# Altium schematic sheet 09_MRAM_RTC_WDT.SchDoc
size 420 x 297 mm; SheetNumber: 16; SheetTotal: 29
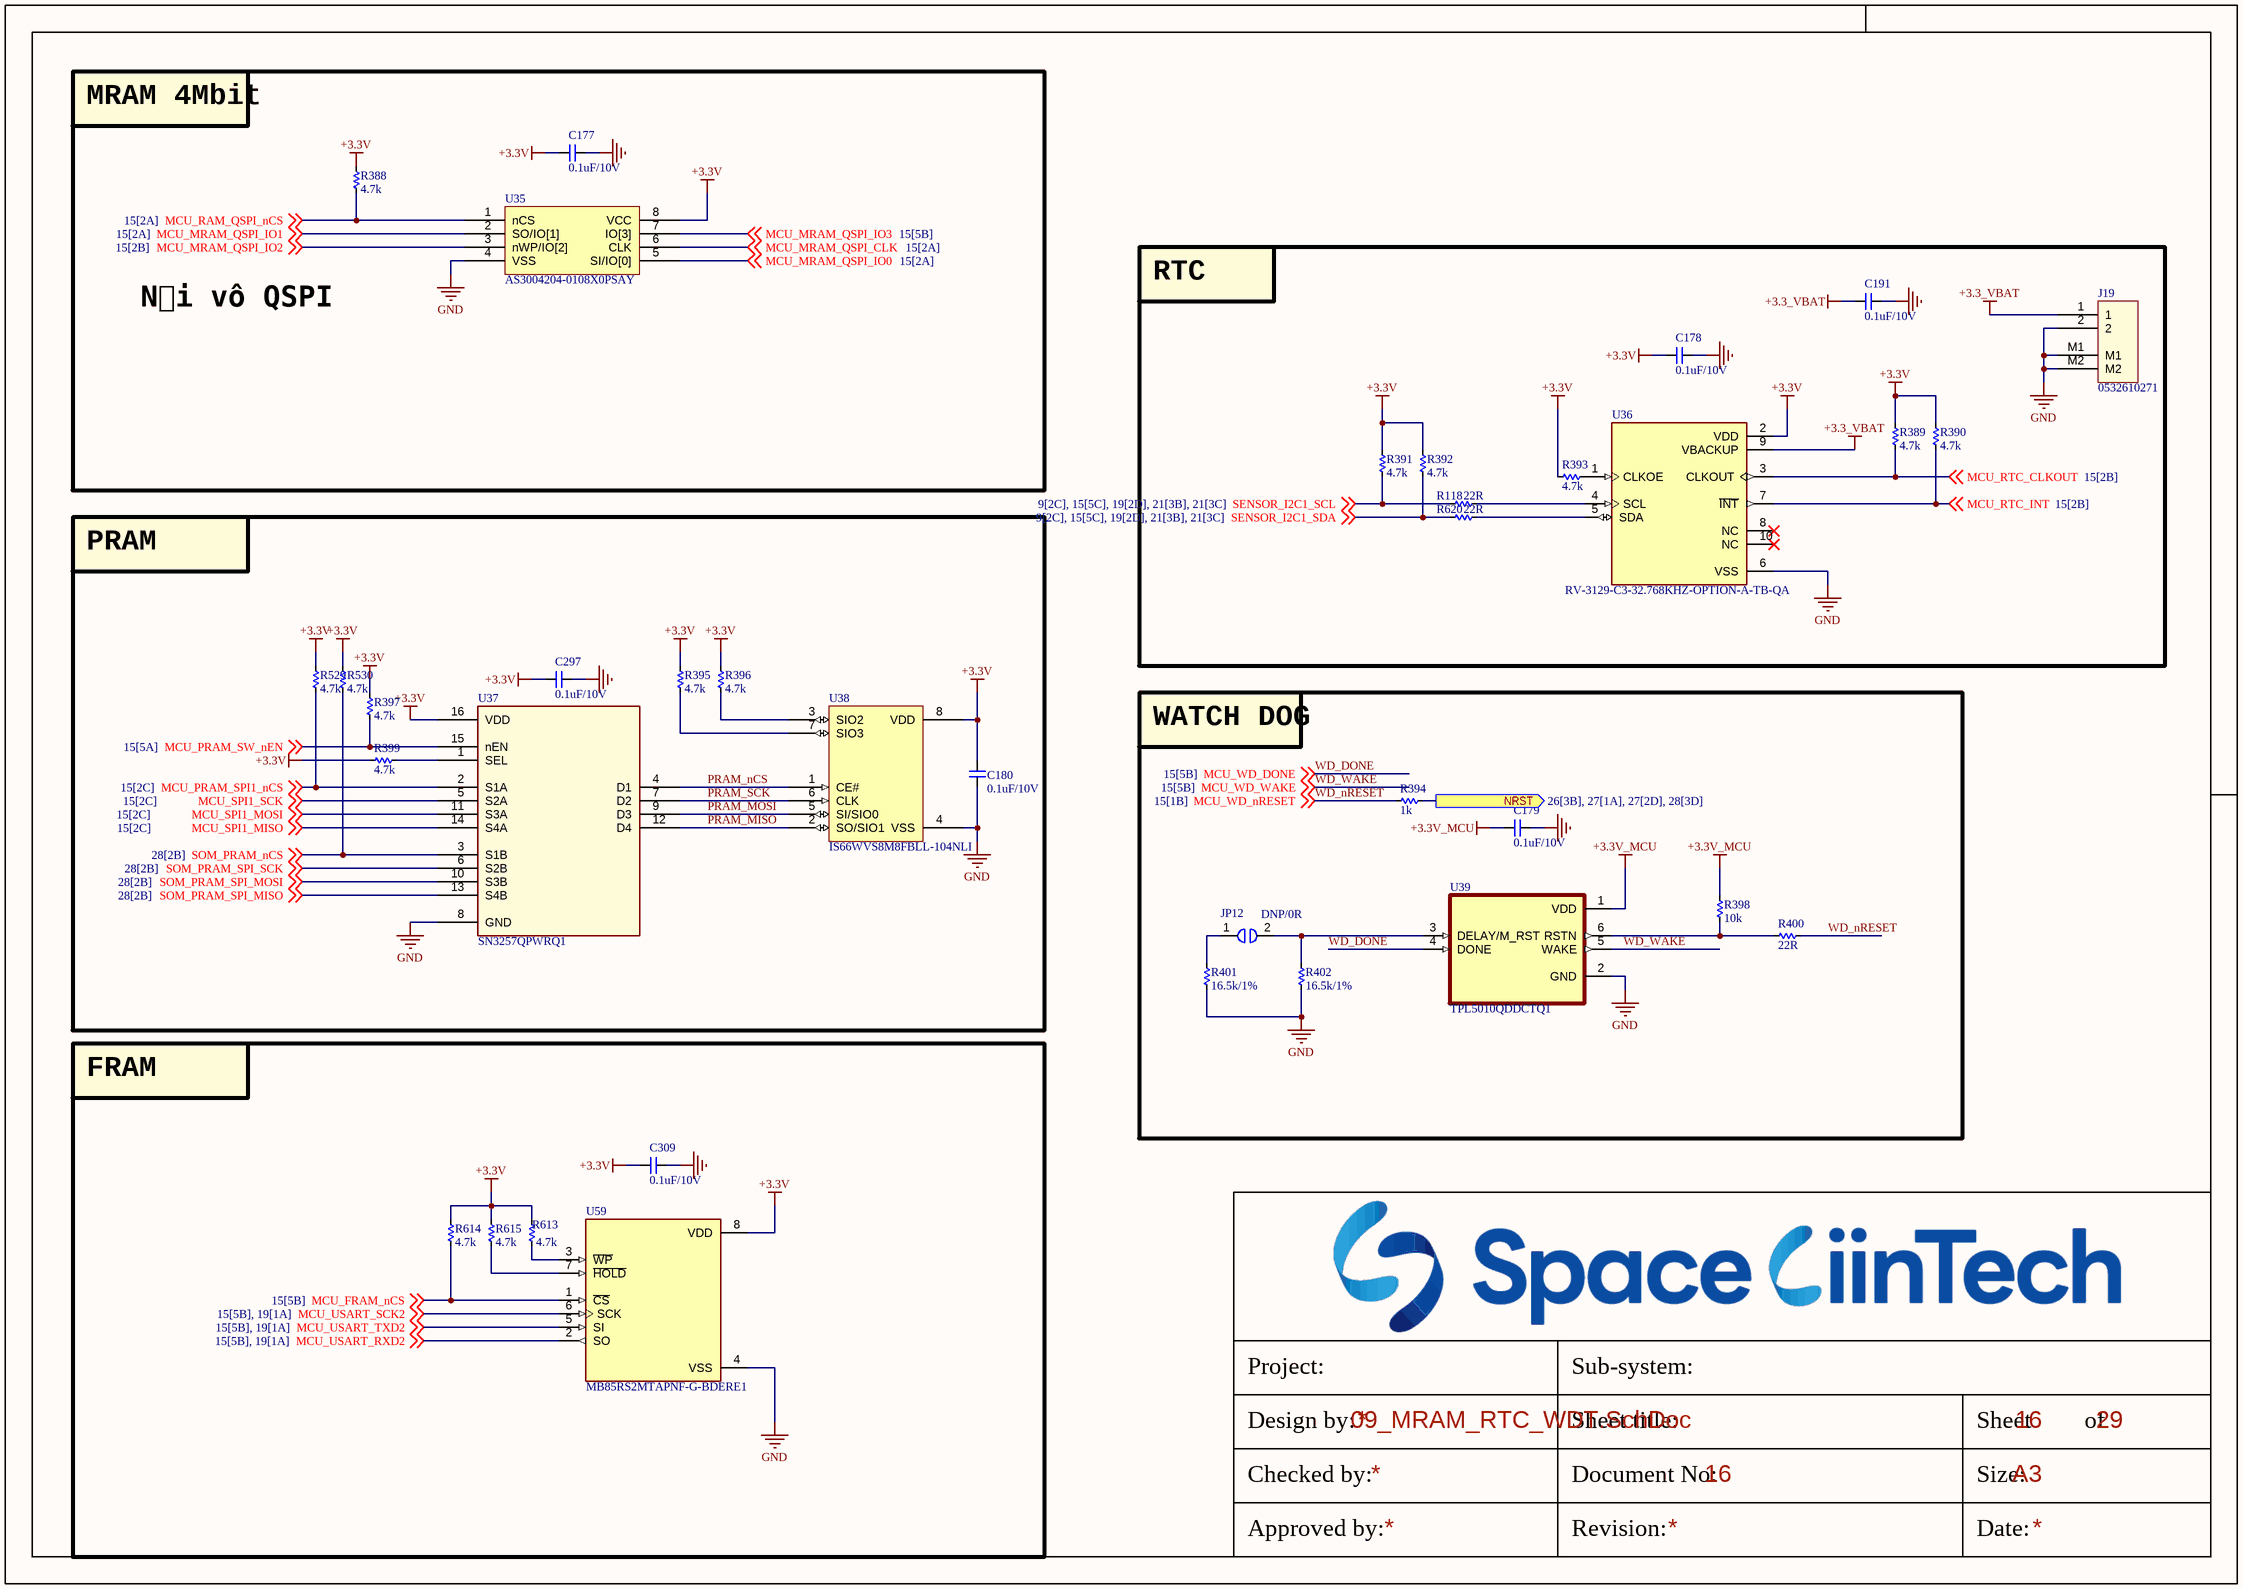
[diagram p0: 09_MRAM_RTC_WDT.SchDoc]

## Parts
C177  0.1uF/10V  [CAP_C_1005X60]
C178  0.1uF/10V  [CAP_C_1005X60]
C179  0.1uF/10V  [CAP_C_1005X60]
C180  0.1uF/10V  [CAP_C_1005X60]
C191  0.1uF/10V  [CAP_C_1005X60]
C297  0.1uF/10V  [CAP_C_1005X60]
C309  0.1uF/10V  [CAP_C_1005X60]
J19  0532610271  [MOLEX_0532610271]
JP12  DNP/0R  [RES_C_1608X60]
R118  22R  [RES_C_1005X40]
R388  4.7k  [RES_C_1005X40]
R389  4.7k  [RES_C_1005X40]
R390  4.7k  [RES_C_1005X40]
R391  4.7k  [RES_C_1005X40]
R392  4.7k  [RES_C_1005X40]
R393  4.7k  [RES_C_1005X40]
R394  1k  [RES_C_1005X40]
R395  4.7k  [RES_C_1005X40]
R396  4.7k  [RES_C_1005X40]
R397  4.7k  [RES_C_1005X40]
R398  10k  [RES_C_1005X40]
R399  4.7k  [RES_C_1005X40]
R400  22R  [RES_C_1005X40]
R401  16.5k/1%  [RES_C_1005X40]
R402  16.5k/1%  [RES_C_1005X40]
R529  4.7k  [RES_C_1005X40]
R530  4.7k  [RES_C_1005X40]
R613  4.7k  [RES_C_1005X40]
R614  4.7k  [RES_C_1005X40]
R615  4.7k  [RES_C_1005X40]
R620  22R  [RES_C_1005X40]
U35  AS3004204-0108X0PSAY  [SOIC127P790X216-8]
U36  RV-3129-C3-32.768KHZ-OPTION-A-TB-QA  [IC_RV-3129-C3_32.768KHZ_OPTION_A_TB_QA]
U37  SN3257QPWRQ1  [SOIC_PRQ1_TEX]
U38  IS66WVS8M8FBLL-104NLI  [SOIC8_150MIL_N_ISI]
U39  TPL5010QDDCTQ1  [SOT95P280X145-6N]
U59  MB85RS2MTAPNF-G-BDERE1  [SOIC127P602X173-8N]

## Blocks framed on the sheet
RTC: C178 C191 J19 R118 R389-R393 R620 U36
PRAM: C180 C297 R395-R397 R399 R529 R530 U37 U38
WATCH DOG: C179 JP12 R394 R398 R400-R402 U39
FRAM: C309 R613-R615 U59

## Ports
NRST (out, see 26[3B], 27[1A], 27[2D], 28[3D])

## Nets
+3.3_VBAT: C191.2 J19.1 U36.9(VBACKUP)
+3.3V: C177.2 C178.2 C180.1 C297.2 C309.2 R388.2 R389.2 R390.2 R391.2 R392.2 R393.2 R395.2 R396.2 R397.2 R399.2 R529.2 R530.2 R613.2 R614.2 R615.2 U35.8(VCC) U36.2(VDD) U37.16(VDD) U38.8(VDD) U59.8(VDD)
+3.3V_MCU: C179.2 R398.2 U39.1(VDD)
GND: C177.1 C178.1 C179.1 C180.2 C191.1 C297.1 C309.1 J19.2 J19.M1 J19.M2 R401.1 R402.1 U35.4(VSS) U36.6(VSS) U37.8(GND) U38.4(VSS) U39.2(GND) U59.4(VSS)
MCU_FRAM_nCS: R614.1 U59.1(~{CS}) ; off-sheet MCU_FRAM_nCS
MCU_MRAM_QSPI_CLK: U35.6(CLK) ; off-sheet MCU_MRAM_QSPI_CLK
MCU_MRAM_QSPI_IO0: U35.5(SI/IO[0]) ; off-sheet MCU_MRAM_QSPI_IO0
MCU_MRAM_QSPI_IO1: U35.2(SO/IO[1]) ; off-sheet MCU_MRAM_QSPI_IO1
MCU_MRAM_QSPI_IO2: U35.3(nWP/IO[2]) ; off-sheet MCU_MRAM_QSPI_IO2
MCU_MRAM_QSPI_IO3: U35.7(IO[3]) ; off-sheet MCU_MRAM_QSPI_IO3
MCU_PRAM_SPI1_nCS: R529.1 U37.2(S1A) ; off-sheet MCU_PRAM_SPI1_nCS
MCU_PRAM_SW_nEN: R397.1 U37.15(nEN) ; off-sheet MCU_PRAM_SW_nEN
MCU_RAM_QSPI_nCS: R388.1 U35.1(nCS) ; off-sheet MCU_RAM_QSPI_nCS
MCU_RTC_CLKOUT: R389.1 U36.3(CLKOUT) ; off-sheet MCU_RTC_CLKOUT
MCU_RTC_INT: R390.1 U36.7(~{INT}) ; off-sheet MCU_RTC_INT
MCU_SPI1_MISO: U37.14(S4A) ; off-sheet MCU_SPI1_MISO
MCU_SPI1_MOSI: U37.11(S3A) ; off-sheet MCU_SPI1_MOSI
MCU_SPI1_SCK: U37.5(S2A) ; off-sheet MCU_SPI1_SCK
MCU_USART_RXD2: U59.2(SO) ; off-sheet MCU_USART_RXD2
MCU_USART_SCK2: U59.6(SCK) ; off-sheet MCU_USART_SCK2
MCU_USART_TXD2: U59.5(SI) ; off-sheet MCU_USART_TXD2
NRST: R394.1 ; port NRST
PRAM_MISO: U37.12(D4) U38.2(SO/SIO1)
PRAM_MOSI: U37.9(D3) U38.5(SI/SIO0)
PRAM_nCS: U37.4(D1) U38.1(CE#)
PRAM_SCK: U37.7(D2) U38.6(CLK)
SENSOR_I2C1_SCL: R118.1 R391.1 ; off-sheet SENSOR_I2C1_SCL
SENSOR_I2C1_SDA: R392.1 R620.1 ; off-sheet SENSOR_I2C1_SDA
SOM_PRAM_nCS: R530.1 U37.3(S1B) ; off-sheet SOM_PRAM_nCS
SOM_PRAM_SPI_MISO: U37.13(S4B) ; off-sheet SOM_PRAM_SPI_MISO
SOM_PRAM_SPI_MOSI: U37.10(S3B) ; off-sheet SOM_PRAM_SPI_MOSI
SOM_PRAM_SPI_SCK: U37.6(S2B) ; off-sheet SOM_PRAM_SPI_SCK
WD_DONE: U39.4(DONE) ; off-sheet MCU_WD_DONE  [also labelled MCU_WD_DONE]
WD_nRESET: R394.2 R400.1 ; off-sheet MCU_WD_nRESET  [also labelled MCU_WD_nRESET]
WD_WAKE: U39.5(WAKE) ; off-sheet MCU_WD_WAKE  [also labelled MCU_WD_WAKE]
NetJP12_1: JP12.1 R401.2
NetJP12_2: JP12.2 R402.2 U39.3(DELAY/M_RST)
NetR118_2: R118.2 U36.4(SCL)
NetR393_1: R393.1 U36.1(CLKOE)
NetR395_1: R395.1 U38.7(SIO3)
NetR396_1: R396.1 U38.3(SIO2)
NetR398_1: R398.1 R400.2 U39.6(RSTN)
NetR399_1: R399.1 U37.1(SEL)
NetR613_1: R613.1 U59.3(~{WP})
NetR615_1: R615.1 U59.7(~{HOLD})
NetR620_2: R620.2 U36.5(SDA)

Not connected (* = marked no-connect by the designer): U36 8(NC)* 10(NC)*

## Notes on the sheet
- MRAM 4Mbit
- Nối vô QSPI
- Project:
- Sub-system:
- Design by:
- Sheet title:
- Sheet
- of
- Checked by:
- Approved by:
- Revision:
- Document No:
- Size:
- Date:
- A3

## Library data of the parts
C177-C180 C191 C297 C309 = _CAP_C_2: CAP CHIP
J19 = Header 2x1_2M
JP12 = JUMPER_1_1
R118 R388-R402 R529 R530 R613-R615 R620 = _RES_B_2: RES
U35 = IC_RAM_AS3004204-0108X0PSAY
U36 = RV-3129-C3_32.768KHZ_OPTION_A_TB_QA: Real-Time Clock Module, Temperature compensated, in 2.5 x 3.7 mm package; MF: Micro Crystal; MP: RV-3129-C3 32.768KHZ OPTION A TB QA; SnapEDA_Link: https://www.snapeda.com/parts/RV-3129-C3%2032.768KHZ%20OPTION%20A%20TB%20QA/Micro+Crystal/view-part/?ref=snap; Package: QFN-10 Micro Crystal; Value: *; Check_prices: https://www.snapeda.com/parts/RV-3129-C3%2032.768KHZ%20OPTION%20A%20TB%20QA/Micro+Crystal/view-part/?ref=eda
U37 = IC_SW_SPI_SN3257QPWRQ1: Automotive 5-V, 2:1 (SPDT), 4-channel switch with 1.8-V logic and powered-off protection 16-TSSOP -40 to 125; Manufacturer_Name: Texas Instruments; Copyright: Copyright (C) 2025 Ultra Librarian. All rights reserved.; Manufacturer_Part_Number: SN3257QPWRQ1; Datasheet: https://www.ti.com/lit/gpn/sn3257-q1; RefDes: RefDes; Type: Type
U38 = IS66WVS4M8BLL-104NLI: No Description Available; Manufacturer_Name: ISSI; Type: Memory; Copyright: Copyright (C) 2025 Ultra Librarian. All rights reserved.; Manufacturer_Part_Number: IS66WVS4M8BLL-104NLI; RefDes: RefDes
U59 = MB85RS2MTAPNF-G-BDERE1: FRAM _Ferroelectric RAM_ Memory IC 2Mb _256K x 8_ SPI 40MHz 8-SOP; MF: Fujitsu Electronics; Package: SO-8 Fujitsu; Value: *; Digi-Key_Purchase_URL: https://www.digikey.com/product-detail/en/fujitsu-electronics-america-inc/MB85RS2MTAPNF-G-BDERE1/865-1286-1-ND/7916252?utm_source=snapeda&utm_medium=aggregator&utm_campaign=symbol; Digi-Key_Part_Number: 865-1286-1-ND; SnapEDA_Link: https://www.snapeda.com/parts/MB85RS2MTAPNF-G-BDERE1/Fujitsu%20Electronics%20America%2C%20Inc./view-part/2344795/?ref=snap; MP: MB85RS2MTAPNF-G-BDERE1
U39 = TPL5010QDDCTQ1: Package: None; Price: None; Value: *; MP: TPL5010QDDCTQ1; Availability: Unavailable